# Altium schematic sheet TestSchematic.SchDoc
size A; SheetNumber: 1; SheetTotal: 2
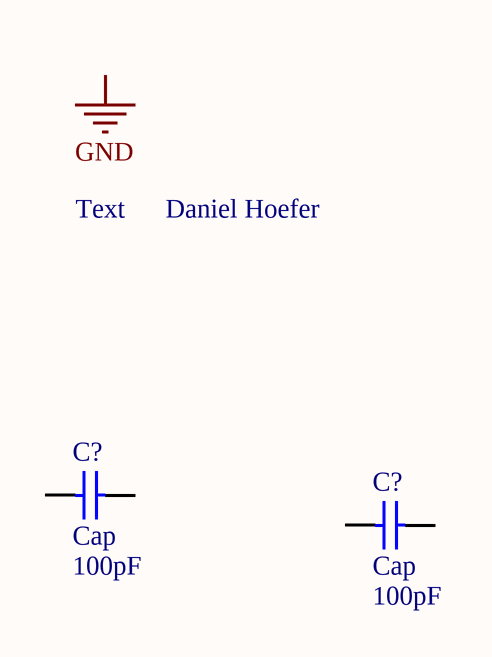
[diagram p0: TestSchematic.SchDoc]

## Parts
(Parts that share a designator on the sheet are numbered #1, #2 ... from top to bottom, then left to right.)
C?#1  Cap  value 100pF  [RAD-0.3]
C?#2  Cap  value 100pF  [RAD-0.3]

## Nets

Not connected (* = marked no-connect by the designer): C?#1 1 2; C?#2 1 2

## Notes on the sheet
- Text
- Daniel Hoefer
- Labels drawn without touching a wire or pin: GND

## Library data of the parts
C?#1 C?#2 = Cap: Capacitor; Published: 8-Jun-2000; LatestRevisionDate: 17-Jul-2002; LatestRevisionNote: Re-released for DXP Platform.; PackageReference: RAD-0.3; Publisher: Altium Limited; PackageDescription: Radial Cap, Thru-Hole; 2 Leads; 0.3 in Pin Spacing